# Altium schematic sheet volt_mon.SchDoc: Transiently Powered Computers
size Letter; Author: Hrishikesh Jayakumar; DrawnBy: 2; Engineer: Hrishikesh; Organization: Embedded Systems Lab; Address1: 465 Northwestern Avenue; Address2: ECE Dept; Address3: Purdue University; Address4: West Lafayette, IN 47907; DocumentNumber: 2; Revision: B; SheetNumber: 2; SheetTotal: 6; DocumentName: ISHIDDEN=T
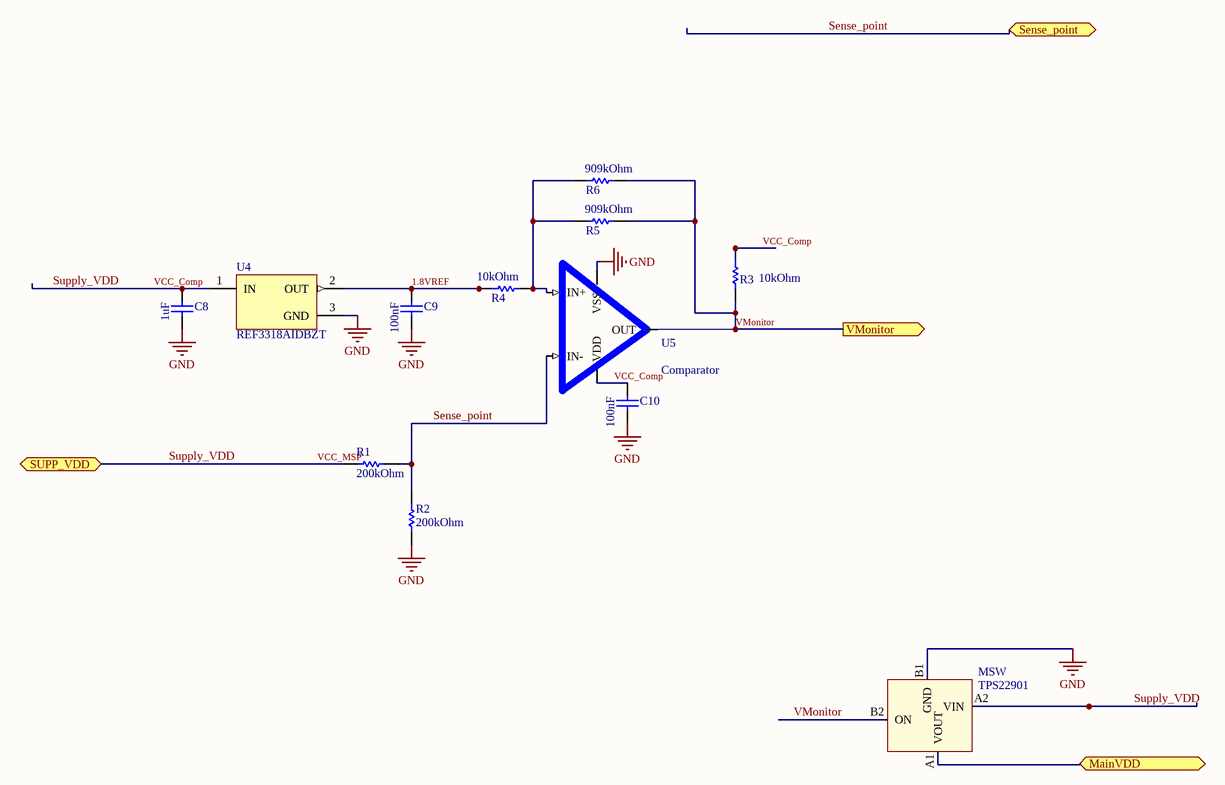
[diagram p0: volt_mon.SchDoc]

## Parts
C8  value 1uF  [CAPC0402(1005)60_N]  (hidden comment: CAP 1uF 4V 0402(1005))
C9  value 100nF  [CAPC0402(1005)60_N]  (hidden comment: CAP 1uF 4V 0402(1005))
C10  value 100nF  [CAPC0402(1005)60_N]  (hidden comment: CAP 1uF 4V 0402(1005))
MSW  TPS22901  [BGA4C40P2X2_76X76X50]
R1  value 200kOhm  [RESC0805(2012)_M]  (hidden comment: 3R3 5% 0805(2012))
R2  value 200kOhm  [RESC0805(2012)_M]  (hidden comment: 3R3 5% 0805(2012))
R3  value 10kOhm  [RESC0805(2012)_M]  (hidden comment: 3R3 5% 0805(2012))
R4  value 10kOhm  [RESC0805(2012)_M]  (hidden comment: 3R3 5% 0805(2012))
R5  value 909kOhm  [RESC0805(2012)_M]  (hidden comment: 3R3 5% 0805(2012))
R6  value 909kOhm  [RESC0805(2012)_M]  (hidden comment: 3R3 5% 0805(2012))
U4  REF3318AIDBZT  [TI-DBZ3_N]
U5  Comparator  [SOT95P270X145-5N]

## Ports
MainVDD (bidir), Sense_point (bidir), SUPP_VDD, VMonitor (out)

## Nets
GND: C8.1 C9.1 C10.1 MSW.B1(GND) R2.1 U4.3(GND) U5.GND(VSS)
1.8VREF: C9.2 R4.2 U4.2(OUT)
MainVDD: MSW.A1(VOUT) ; port MainVDD
Sense_point: R1.2 R2.2 U5.input-(IN-) ; port Sense_point
Supply_VDD: C8.2 C10.2 MSW.A2(VIN) R1.1 R3.2 U4.1(IN) U5.VDD ; port SUPP_VDD  [also labelled VCC_Comp, VCC_MSP]
VMonitor: MSW.B2(ON) R3.1 R5.1 R6.1 U5.OUT ; port VMonitor
NetR4_1: R4.1 R5.2 R6.2 U5.input+(IN+)

## Notes on the sheet
- Title
- Size:
- Date:
- Letter
- Number:
- Time:
- Revision:
- Sheet
- of
- File:

## Library data of the parts
C8-C10 = CMP-1034-02111-1: CAP 1uF 4V ±10% 0402 (1005 Metric) Thickness 0.6mm SMD; Case-Metric: 1005; Case-EIA: 0402; Max Thickness: 0.6 mm; Technology: SMT; Tolerance: ±10%; Rated Voltage: 4 V
R1-R6 = CMP-1013-00014-1: 3R3 0.125W 5% 0805 (2012 Metric)  SMD; Case-Metric: 2012; Case-EIA: 0805; Technology: SMT; Tolerance: 5 %; Power: 0.125 W
U4 = CMP-0367-00129-1: 30 ppm / degC Drift, 3.9 uA Voltage Reference, -40 to 125 degC, 3-pin SOT-23 (DBZ), Green (RoHS & no Sb/Br); Manufacturer: Texas Instruments; Rating: Catalog; Temp Coeff(Typ)(ppm/ degree C): 8; VI(Min)(V): 1.98; SubFamily: Series Voltage Reference; VO(V): 1.8; Iq(Max)(uA): 5; VI(Max)(V): 5.5; Temp Coeff(Max)(ppm/ degree C): 30; ComponentLink3Description: Package Specification; ComponentLink2URL: http://www.ti.com/general/docs/lit/getliterature.tsp?genericPartNumber=REF3318&fileType=pdf; PackageVersion: 4203227/B; Eco-Plan: Green (RoHS & no Sb/Br); PartNumber: REF3318AIDBZT; Code_JEDEC: TO-236; ComponentLink3URL: http://www.ti.com/litv/pdf/mpds108a; ComponentLink1Description: Manufacturer URL; Mounting Technology: Surface Mount; DatasheetVersion: SBOS392A; PackageDescription: 3-Pin Plastic Small Outline, Body 2.92 x 1.3 mm, Pitch 0.95 mm; Iout/Iz(Max)(mA): 5; ComponentLink1URL: http://www.ti.com/; PackageReference: DBZ3; ComponentLink2Description: Datasheet
U5 = Comparator: pin to pad: GND>5 input+>3 input->4 OUT>1 VDD>2